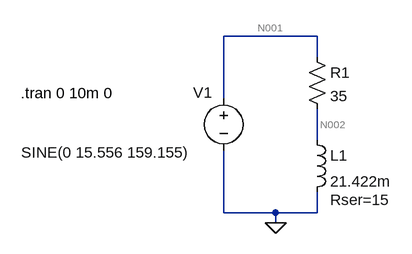
[diagram p0: schematic 1_5.asc]
1_5.asc, the LTspice schematic file:
Version 4.1
SHEET 1 880 680
WIRE 320 -16 176 -16
WIRE 320 16 320 -16
WIRE 176 80 176 -16
WIRE 320 144 320 96
WIRE 176 256 176 160
WIRE 256 256 176 256
WIRE 320 256 320 224
WIRE 320 256 256 256
WIRE 256 272 256 256
FLAG 256 272 0
SYMBOL voltage 176 64 R0
WINDOW 123 0 0 Left 0
WINDOW 39 24 124 Left 2
WINDOW 0 -47 7 Left 2
WINDOW 3 -311 99 Left 2
SYMATTR InstName V1
SYMATTR Value SINE(0 15.556 159.155)
SYMBOL res 304 0 R0
SYMATTR InstName R1
SYMATTR Value 35
SYMBOL ind 304 128 R0
WINDOW 39 36 108 Left 2
SYMATTR SpiceLine Rser=15
SYMATTR InstName L1
SYMATTR Value 21.422m
TEXT -136 72 Left 2 !.tran 0 10m 0

The netlist it stands for:
* 1_5.asc
V1 N001 0 SINE(0 15.556 159.155)
R1 N001 N002 35
L1 N002 0 21.422m Rser=15
.tran 0 10m 0
.backanno
.end

* Results of the author's LTspice run, read from the files saved beside the schematic
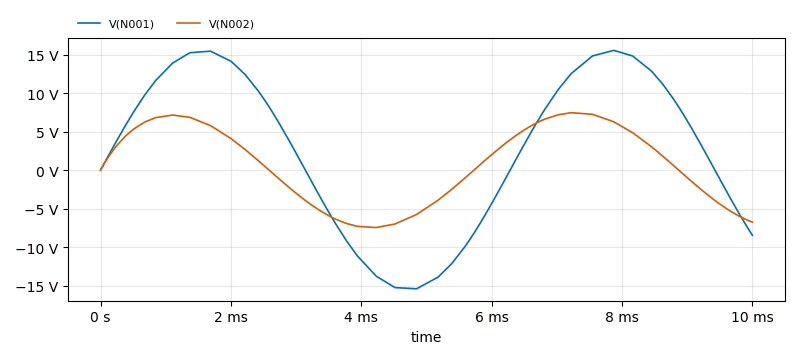
[diagram p1: Transient Analysis of 1_5.asc, plotted from the saved traces]
* Transient Analysis, 1 run:
*   V(N001): min -15.41 V, max 15.55 V, average 2.846 V, rms 10.7 V, last -8.463 V
*   V(N002): min -7.46 V, max 7.456 V, average 778.4 mV, rms 5.142 V, last -6.765 V